# EAGLE schematic Meshtastic-DIY_v2 (EAGLE 9.6.2)
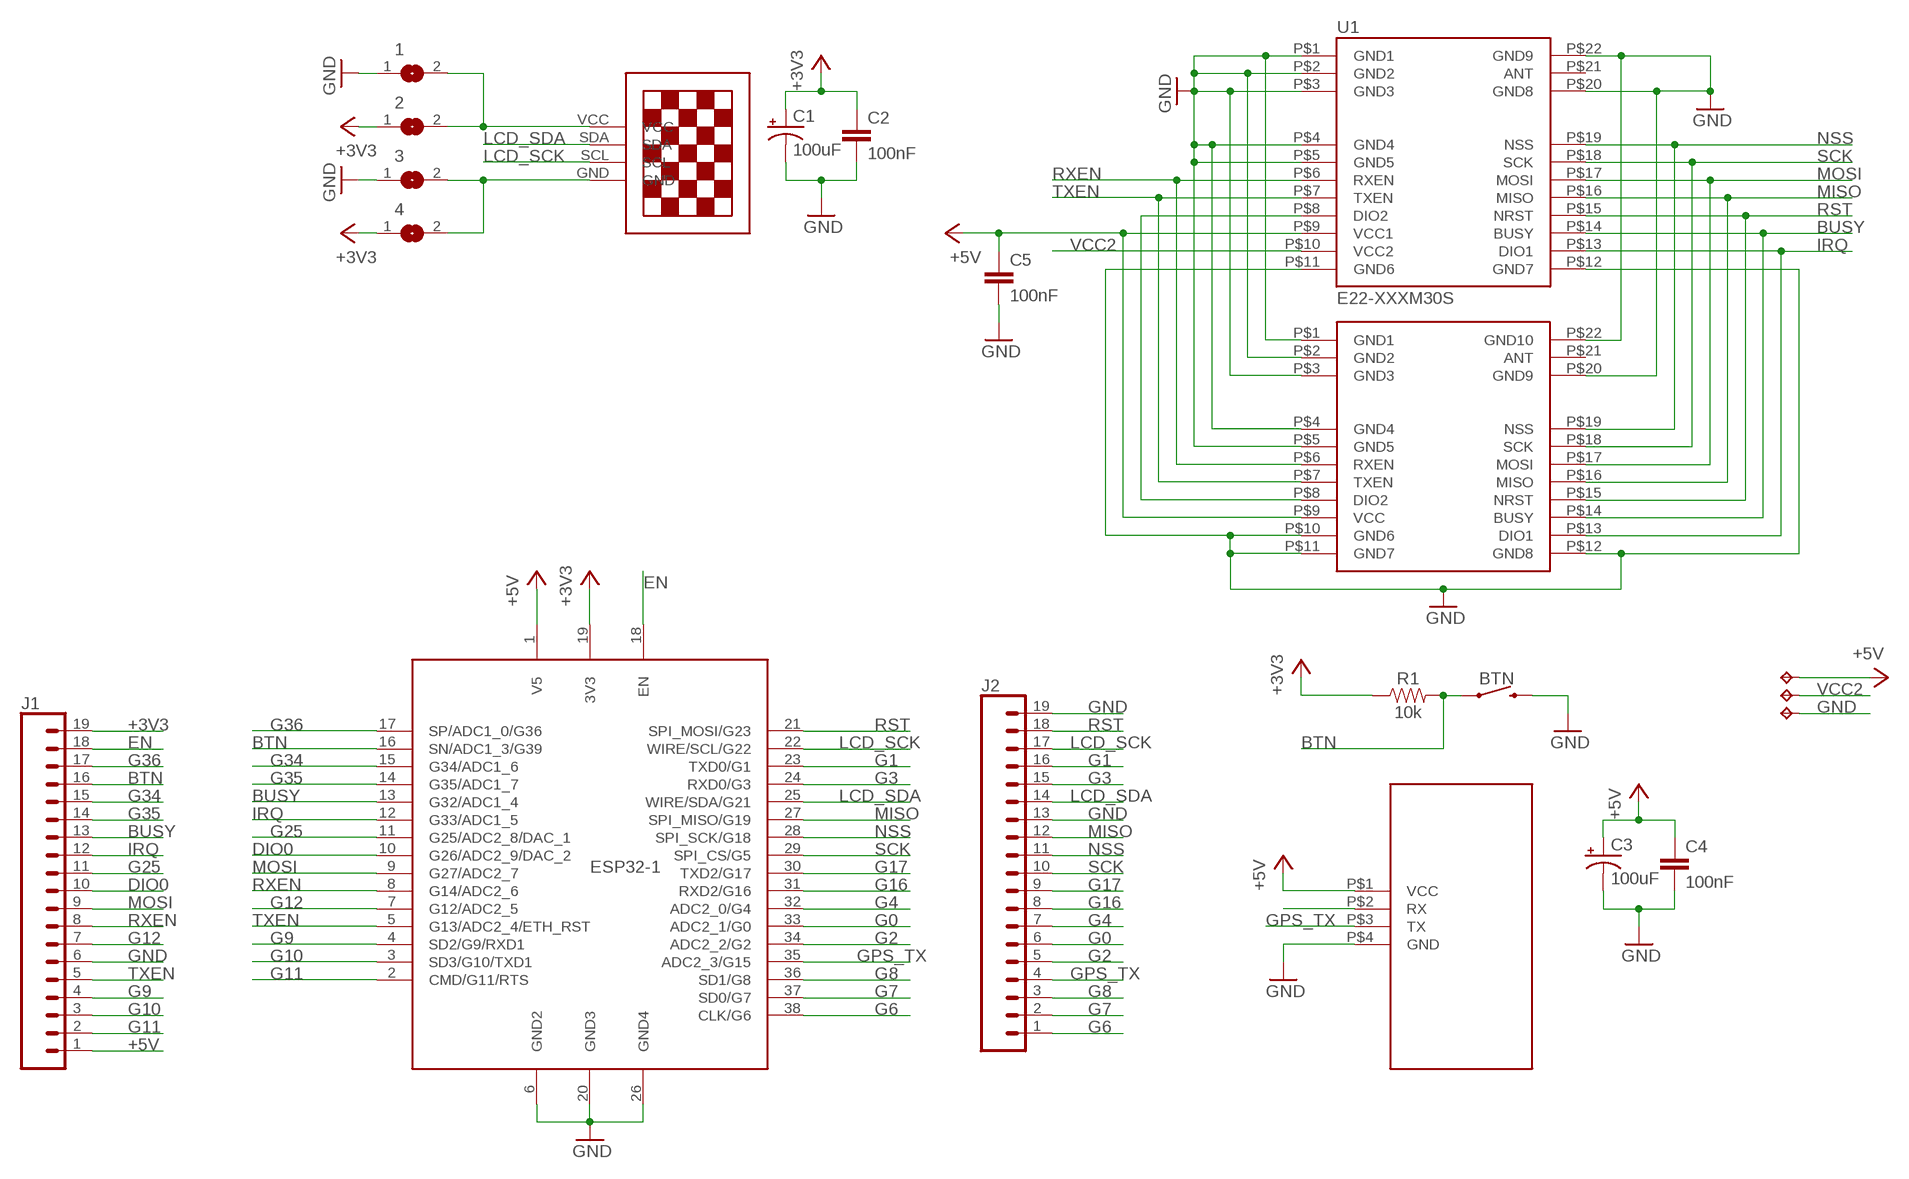
[diagram p0: schematic, sheet 1]

## Parts
1  SJ  [SJ]
2  SJ  [SJ]
3  SJ  [SJ]
4  SJ  [SJ]
BTN  MOMENTARY-SWITCH-SPST-PTH-6.0MM  [TACTILE_SWITCH_PTH_6.0MM]
C1  100uF  100UF-POLAR-EIA7343-10V-10%(TANT)  [EIA7343]
C2  100nF  0.33UF/330NF-0805-50V-10%  [0805]
C3  100uF  100UF-POLAR-EIA7343-10V-10%(TANT)  [EIA7343]
C4  100nF  0.33UF/330NF-0805-50V-10%  [0805]
C5  100nF  0.33UF/330NF-0805-50V-10%  [0805]
ESP32-1  NODEMCU_ESP32_WROOM_32  [NODEMCU_ESP32_WROOM_32--38PINS]
J1  CONN_191X19_NO_SILK  [1X19_NO_SILK]
J2  CONN_191X19_NO_SILK  [1X19_NO_SILK]
R1  10k  0.1OHM-1210-1/2W-1%  [1210]
TP1  TPTP14SQ  [TP14SQ]
TP2  TPTP14SQ  [TP14SQ]
TP3  TPTP14SQ  [TP14SQ]
U1  E22-XXXM30S  [E22-XXXM30S]
U$1  13"OLED13"OLED  [1.3"OLED]
U$2  E22-XXXM22S  [E22-XXXM22S]
U$3  GPS-NEO  [GPS-NEO]

## Nets
+3V3: 2.1 4.1 C1.A(+) C2.1 ESP32-1.19(3V3) J1.19 R1.1
+5V: C3.A(+) C4.1 C5.1 ESP32-1.1(V5) J1.1 TP1.TP U1.P$9(VCC1) U$2.P$9(VCC) U$3.P$1(VCC)
BTN: BTN.1 ESP32-1.16(SN/ADC1_3/G39) J1.16 R1.2
BUSY: ESP32-1.13(G32/ADC1_4) J1.13 U1.P$14(BUSY) U$2.P$14(BUSY)
DIO0: ESP32-1.10(G26/ADC2_9/DAC_2) J1.10
EN: ESP32-1.18(EN) J1.18
G0: ESP32-1.33(ADC2_1/G0) J2.6
G1: ESP32-1.23(TXD0/G1) J2.16
G2: ESP32-1.34(ADC2_2/G2) J2.5
G3: ESP32-1.24(RXD0/G3) J2.15
G4: ESP32-1.32(ADC2_0/G4) J2.7
G6: ESP32-1.38(CLK/G6) J2.1
G7: ESP32-1.37(SD0/G7) J2.2
G8: ESP32-1.36(SD1/G8) J2.3
G9: ESP32-1.4(SD2/G9/RXD1) J1.4
G10: ESP32-1.3(SD3/G10/TXD1) J1.3
G11: ESP32-1.2(CMD/G11/RTS) J1.2
G12: ESP32-1.7(G12/ADC2_5) J1.7
G16: ESP32-1.31(RXD2/G16) J2.8
G17: ESP32-1.30(TXD2/G17) J2.9
G25: ESP32-1.11(G25/ADC2_8/DAC_1) J1.11
G34: ESP32-1.15(G34/ADC1_6) J1.15
G35: ESP32-1.14(G35/ADC1_7) J1.14
G36: ESP32-1.17(SP/ADC1_0/G36) J1.17
GND: 1.1 3.1 BTN.3 C1.C(-) C2.2 C3.C(-) C4.2 C5.2 ESP32-1.6(GND2) ESP32-1.20(GND3) ESP32-1.26(GND4) J1.6 J2.13 J2.19 TP3.TP U1.P$1(GND1) U1.P$2(GND2) U1.P$3(GND3) U1.P$4(GND4) U1.P$5(GND5) U1.P$11(GND6) U1.P$12(GND7) U1.P$20(GND8) U1.P$22(GND9) U$2.P$1(GND1) U$2.P$2(GND2) U$2.P$3(GND3) U$2.P$4(GND4) U$2.P$5(GND5) U$2.P$10(GND6) U$2.P$11(GND7) U$2.P$12(GND8) U$2.P$20(GND9) U$2.P$22(GND10) U$3.P$4(GND)
GPS_TX: ESP32-1.35(ADC2_3/G15) J2.4 U$3.P$3(TX)
IRQ: ESP32-1.12(G33/ADC1_5) J1.12 U1.P$13(DIO1) U$2.P$13(DIO1)
LCD_SCK: ESP32-1.22(WIRE/SCL/G22) J2.17 U$1.SCL
LCD_SDA: ESP32-1.25(WIRE/SDA/G21) J2.14 U$1.SDA
MISO: ESP32-1.27(SPI_MISO/G19) J2.12 U1.P$16(MISO) U$2.P$16(MISO)
MOSI: ESP32-1.9(G27/ADC2_7) J1.9 U1.P$17(MOSI) U$2.P$17(MOSI)
N$1: 3.2 4.2 U$1.GND
N$3: U$3.P$2(RX)
N$4: 1.2 2.2 U$1.VCC
N$9: U1.P$8(DIO2) U$2.P$8(DIO2)
NSS: ESP32-1.28(SPI_SCK/G18) J2.11 U1.P$19(NSS) U$2.P$19(NSS)
RST: ESP32-1.21(SPI_MOSI/G23) J2.18 U1.P$15(NRST) U$2.P$15(NRST)
RXEN: ESP32-1.8(G14/ADC2_6) J1.8 U1.P$6(RXEN) U$2.P$6(RXEN)
SCK: ESP32-1.29(SPI_CS/G5) J2.10 U1.P$18(SCK) U$2.P$18(SCK)
TXEN: ESP32-1.5(G13/ADC2_4/ETH_RST) J1.5 U1.P$7(TXEN) U$2.P$7(TXEN)
VCC2: TP2.TP U1.P$10(VCC2)
Unconnected: U1.P$21(ANT) U$2.P$21(ANT)

## Library data of the parts
1-4 = jumper:SJ: SMD solder JUMPER
BTN = SparkFun-Switches:MOMENTARY-SWITCH-SPST: Momentary Switch (Pushbutton) - SPST Normally-open (NO) SPST momentary switches (buttons, pushbuttons). Variants PTH-12MM - 12mm square, through-hole Momentary Pushbutton Switch - 12mm Square <https://www.sparkfun.com/products/9190> (COM-09190) PTH-6.0MM, PTH-6.0MM-KIT - 6.0mm square, through-hole Mini Pushbutton Switch <https://www.sparkfun.com/products/97> (COM-00097) KIT package intended for soldering kit's - only one side of pads' copper is exposed. PTH-RIGHT-ANGLE-KIT - Right-angle, through-hole Right Angle Tactile Button <https://www.sparkfun.com/products/10791> - Used on SparkFun BigTime Watch Kit <https://www.sparkfun.com/products/11734> SMD-12MM - 12mm square, surface-mount Tactile Button - SMD (12mm) <https://www.sparkfun.com/products/12993> (COM-12993) Used on SparkFun PicoBoard <https://www.sparkfun.com/products/11888> SMD-4.5MM - 4.5mm Square Trackball Switch Used on SparkFun Blackberry Trackballer Breakout <https://www.sparkfun.com/products/13169> SMD-4.6MMX2.8MM - 4.60mm x 2.80mm, surface mount Used on SparkFun SAMD21 Mini Breakout <https://www.sparkfun.com/products/13664> SMD-5.2MM, SMD-5.2-REDUNDANT - 5.2mm square, surface-mount Mini Pushbutton Switch - SMD <https://www.sparkfun.com/products/8720> (COM-08720) Used on Arduino Pro Mini <https://www.sparkfun.com/products/11114> REDUNDANT package connects both switch circuits together SMD-6.0X3.5MM - 6.0 x 3.5mm, surface mount Momentary Reset Switch SMD <https://www.sparkfun.com/products/8229> (COM-08229) SMD-6.2MM-TALL - 6.2mm square, surface mount Tactile Button - SMD (6mm) <https://www.sparkfun.com/products/12992> Used on SparkFun Digital Sandbox <https://www.sparkfun.com/products/12651> SMD-RIGHT-ANGLE - Right-angle, surface mount Used on SparkFun Block for Intel® Edison - Arduino <https://www.sparkfun.com/products/13036>; PROD_ID: SWCH-08441; SF_SKU: COM-00097
C1 C3 = SparkFun-Capacitors:100UF-POLAR: 100µF polarized capacitors A capacitor is a passive two-terminal electrical component used to store electrical energy temporarily in an electric field.; PROD_ID: CAP-07890
C2 C4 C5 = SparkFun-Capacitors:0.33UF/330NF: 0.33µF/330nF ceramic capacitors A capacitor is a passive two-terminal electrical component used to store electrical energy temporarily in an electric field.; PROD_ID: CAP-08469; VALUE: 0.33µF
ESP32-1 = ESP32 NODEMCU WROOM 32:NODEMCU_ESP32_WROOM_32: NODEMCU ESP32 WROOM 32 38 Pins PINOUT: https://cdn.shopify.com/s/files/1/1509/1638/files/ESP_-_32_NodeMCU_Developmentboard_Pinout_Diagram.jpg?4479111012146266271; ESP: ESP32 WROOM 32
J1 J2 = SparkFun-SEWPAD16:CONN_19: Multi connection point. Often used as Generic Header-pin footprint for 0.1 inch spaced/style header connections On any of the 0.1 inch spaced packages, you can populate with these: Break Away Headers - Straight <https://www.sparkfun.com/products/116> (PRT-00116) Break Away Male Headers - Right Angle <https://www.sparkfun.com/products/553> (PRT-00553) Female Headers <https://www.sparkfun.com/products/115> (PRT-00115) Break Away Headers - Machine Pin <https://www.sparkfun.com/products/117> (PRT-00117) Break Away Female Headers - Swiss Machine Pin <https://www.sparkfun.com/products/743> (PRT-00743) For SCREWTERMINALS and SPRING TERMINALS visit here: Screw Terimnals on SparkFun.com <https://www.sparkfun.com/search/results?term=Screw+Terminals> (5mm/3.5mm/2.54mm spacing) This device is also useful as a general connection point to wire up your design to another part of your project. Our various solder wires solder well into these plated through hole pads. Hook-Up Wire - Assortment (Stranded, 22 AWG) <https://www.sparkfun.com/products/11375> (PRT-11375) Hook-Up Wire - Assortment (Solid Core, 22 AWG) <https://www.sparkfun.com/products/11367> (PRT-11367) View the entire wire category on our website here <https://www.sparkfun.com/categories/141> Special notes: Molex polarized connector foot print use with SKU : PRT-08231 with associated crimp pins and housings. 1MM SMD Version SKU: PRT-10208 NOTES ON THE VARIANTS LOCK and LOCK_LONGPADS... This footprint was designed to help hold the alignment of a through-hole component (i.e. 6-pin header) while soldering it into place. You may notice that each hole has been shifted either up or down by 0.005 of an inch from it's more standard position (which is a perfectly straight line). This slight alteration caused the pins (the squares in the middle) to touch the edges of the holes. Because they are alternating, it causes a "brace" to hold the component in place. 0.005 has proven to be the perfect amount of "off-center" position when using our standard breakaway headers. Although looks a little odd when you look at the bare footprint, once you have a header in there, the alteration is very hard to notice. Also,if you push a header all the way into place, it is covered up entirely on the bottom side.
R1 = SparkFun-Resistors:0.1OHM: 0.1Ω resistor A resistor is a passive two-terminal electrical component that implements electrical resistance as a circuit element. Resistors act to reduce current flow, and, at the same time, act to lower voltage levels within circuits. - Wikipedia; PROD_ID: RES-12374; VALUE: 0.1
TP1-TP3 = testpad:TP: Test pad
U1 = E22-XXXMXXS:E22-XXXM30S
U$1 = 13oled:13"OLED
U$2 = E22-XXXMXXS:E22-XXXM22S
U$3 = 13oled:GPS-NEO